# Altium schematic sheet supply.SchDoc
size 420 x 297 mm
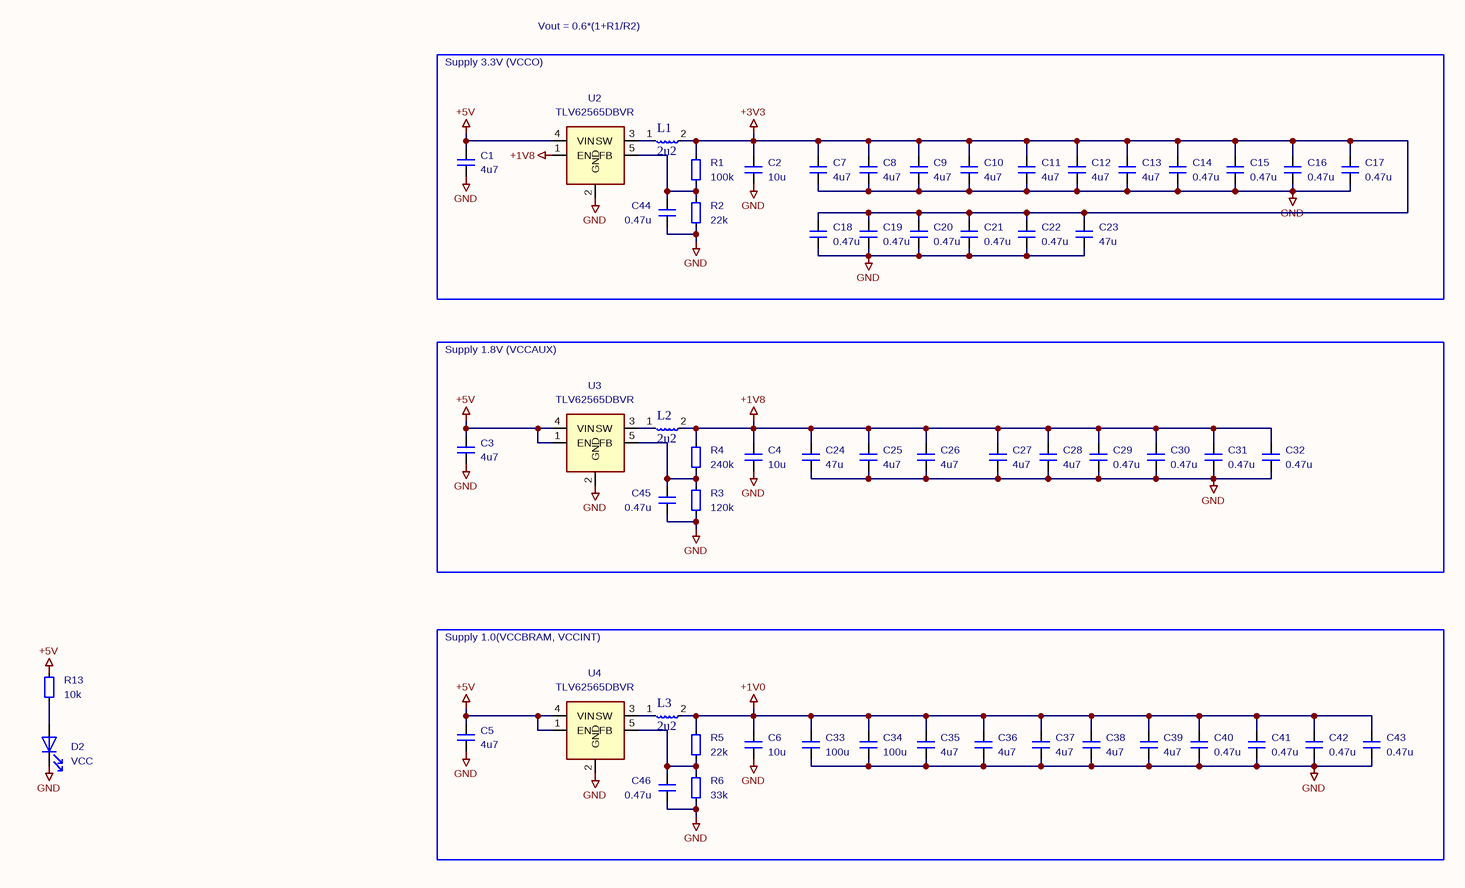
[diagram p0: supply.SchDoc]

## Parts
C1  4u7  [C_0805_2012Metric]
C2  10u  [C_0805_2012Metric]
C3  4u7  [C_0805_2012Metric]
C4  10u  [C_0805_2012Metric]
C5  4u7  [C_0805_2012Metric]
C6  10u  [C_0805_2012Metric]
C7  4u7  [C_0805_2012Metric]
C8  4u7  [C_0805_2012Metric]
C9  4u7  [C_0805_2012Metric]
C10  4u7  [C_0805_2012Metric]
C11  4u7  [C_0805_2012Metric]
C12  4u7  [C_0805_2012Metric]
C13  4u7  [C_0805_2012Metric]
C14  0.47u  [C_0402_1005Metric]
C15  0.47u  [C_0402_1005Metric]
C16  0.47u  [C_0402_1005Metric]
C17  0.47u  [C_0402_1005Metric]
C18  0.47u  [C_0402_1005Metric]
C19  0.47u  [C_0402_1005Metric]
C20  0.47u  [C_0402_1005Metric]
C21  0.47u  [C_0402_1005Metric]
C22  0.47u  [C_0402_1005Metric]
C23  47u  [C_1206_3216Metric]
C24  47u  [C_1206_3216Metric]
C25  4u7  [C_0805_2012Metric]
C26  4u7  [C_0805_2012Metric]
C27  4u7  [C_0805_2012Metric]
C28  4u7  [C_0805_2012Metric]
C29  0.47u  [C_0402_1005Metric]
C30  0.47u  [C_0402_1005Metric]
C31  0.47u  [C_0402_1005Metric]
C32  0.47u  [C_0402_1005Metric]
C33  100u  [C_1206_3216Metric]
C34  100u  [C_1206_3216Metric]
C35  4u7  [C_0805_2012Metric]
C36  4u7  [C_0805_2012Metric]
C37  4u7  [C_0805_2012Metric]
C38  4u7  [C_0805_2012Metric]
C39  4u7  [C_0805_2012Metric]
C40  0.47u  [C_0402_1005Metric]
C41  0.47u  [C_0402_1005Metric]
C42  0.47u  [C_0402_1005Metric]
C43  0.47u  [C_0402_1005Metric]
C44  0.47u  [C_0402_1005Metric]
C45  0.47u  [C_0402_1005Metric]
C46  0.47u  [C_0402_1005Metric]
D2  VCC  [LED_0603_1608Metric]
L1  2u2  [IND_LQH3NPN2R2MJRL]
L2  2u2  [IND_LQH3NPN2R2MJRL]
L3  2u2  [IND_LQH3NPN2R2MJRL]
R1  100k  [R_0402_1005Metric]
R2  22k  [R_0402_1005Metric]
R3  120k  [R_0402_1005Metric]
R4  240k  [R_0402_1005Metric]
R5  22k  [R_0402_1005Metric]
R6  33k  [R_0402_1005Metric]
R13  10k  [R_0402_1005Metric]
U2  TLV62565DBVR  [SOT-23-5]
U3  TLV62565DBVR  [SOT-23-5]
U4  TLV62565DBVR  [SOT-23-5]

## Blocks framed on the sheet
Supply 3.3V (VCCO): C1 C2 C7-C23 C44 L1 R1 R2 U2
Supply 1.8V (VCCAUX): C3 C4 C24-C32 C45 L2 R3 R4 U3
Supply 1.0(VCCBRAM, VCCINT): C5 C6 C33-C43 C46 L3 R5 R6 U4

## Nets
+1V0: C6.1 C33.1 C34.1 C35.1 C36.1 C37.1 C38.1 C39.1 C40.1 C41.1 C42.1 C43.1 L3.2 R5.1
+1V8: C4.1 C24.1 C25.1 C26.1 C27.1 C28.1 C29.1 C30.1 C31.1 C32.1 L2.2 R4.1 U2.1(EN)
+3V3: C2.1 C7.1 C8.1 C9.1 C10.1 C11.1 C12.1 C13.1 C14.1 C15.1 C16.1 C17.1 C18.1 C19.1 C20.1 C21.1 C22.1 C23.1 L1.2 R1.1
+5V: C1.1 C3.1 C5.1 R13.1 U2.4(VIN) U3.1(EN) U3.4(VIN) U4.1(EN) U4.4(VIN)
GND: C1.2 C2.2 C3.2 C4.2 C5.2 C6.2 C7.2 C8.2 C9.2 C10.2 C11.2 C12.2 C13.2 C14.2 C15.2 C16.2 C17.2 C18.2 C19.2 C20.2 C21.2 C22.2 C23.2 C24.2 C25.2 C26.2 C27.2 C28.2 C29.2 C30.2 C31.2 C32.2 C33.2 C34.2 C35.2 C36.2 C37.2 C38.2 C39.2 C40.2 C41.2 C42.2 C43.2 C44.2 C45.2 C46.2 D2.1(K) R2.2 R3.2 R6.2 U2.2(GND) U3.2(GND) U4.2(GND)
NetC44_1: C44.1 R1.2 R2.1 U2.5(FB)
NetC45_1: C45.1 R3.1 R4.2 U3.5(FB)
NetC46_1: C46.1 R5.2 R6.1 U4.5(FB)
NetD2_2: D2.2(A) R13.2
NetL1_1: L1.1 U2.3(SW)
NetL2_1: L2.1 U3.3(SW)
NetL3_1: L3.1 U4.3(SW)

## Notes on the sheet
- Vout = 0.6*(1+R1/R2)
- 1
- 2
- 3
- 4
- 5
- 6
- 7
- 8
- A
- B
- C
- D
- E
- Title:
- File: supply.kicad_sch
- Sheet: /
- F
- KiCad E.D.A.  kicad (5.1.4)-1
- Size: A3
- Date:
- Rev:
- Id: 1/1

## Library data of the parts
C1-C46 = C_Small
  C1 C3 C5 C7-C13 C25-C28 C35-C39: JLCPCB: C162420; Value: 4u7; Footprint: Capacitor_SMD:C_0805_2012Metric
  C2 C4 C6: JLCPCB: C105505; Value: 10u; Footprint: Capacitor_SMD:C_0805_2012Metric
  C14-C22 C29-C32 C40-C46: JLCPCB: C106255; Value: 0.47u; Footprint: Capacitor_SMD:C_0402_1005Metric
  C23 C24: JLCPCB: C385907; Value: 47u; Footprint: Capacitor_SMD:C_1206_3216Metric
  C33 C34: JLCPCB: C268006; Value: 100u; Footprint: Capacitor_SMD:C_1206_3216Metric
D2 = LED: JLCPCB: C601673; Value: VCC; Footprint: LED_SMD:LED_0603_1608Metric
L1-L3 = L_Small
R1-R6 R13 = R_Small: Footprint: Resistor_SMD:R_0402_1005Metric
  R1: JLCPCB: C131362; Value: 100k
  R2 R5: JLCPCB: C409681; Value: 22k
  R3: JLCPCB: C323683; Value: 120k
  R4: JLCPCB: C323663; Value: 240k
  R6: JLCPCB: C416388; Value: 33k
  R13: JLCPCB: C328298; Value: 10k
U2-U4 = NCP1529A: Value: TLV62565DBVR; Footprint: Package_TO_SOT_SMD:SOT-23-5
  U2: JLCPCB: C87122
  U3 U4: JLCPCB: C23902